# EasyEDA Pro project 4090ovo(003).epro, board 003(4090)
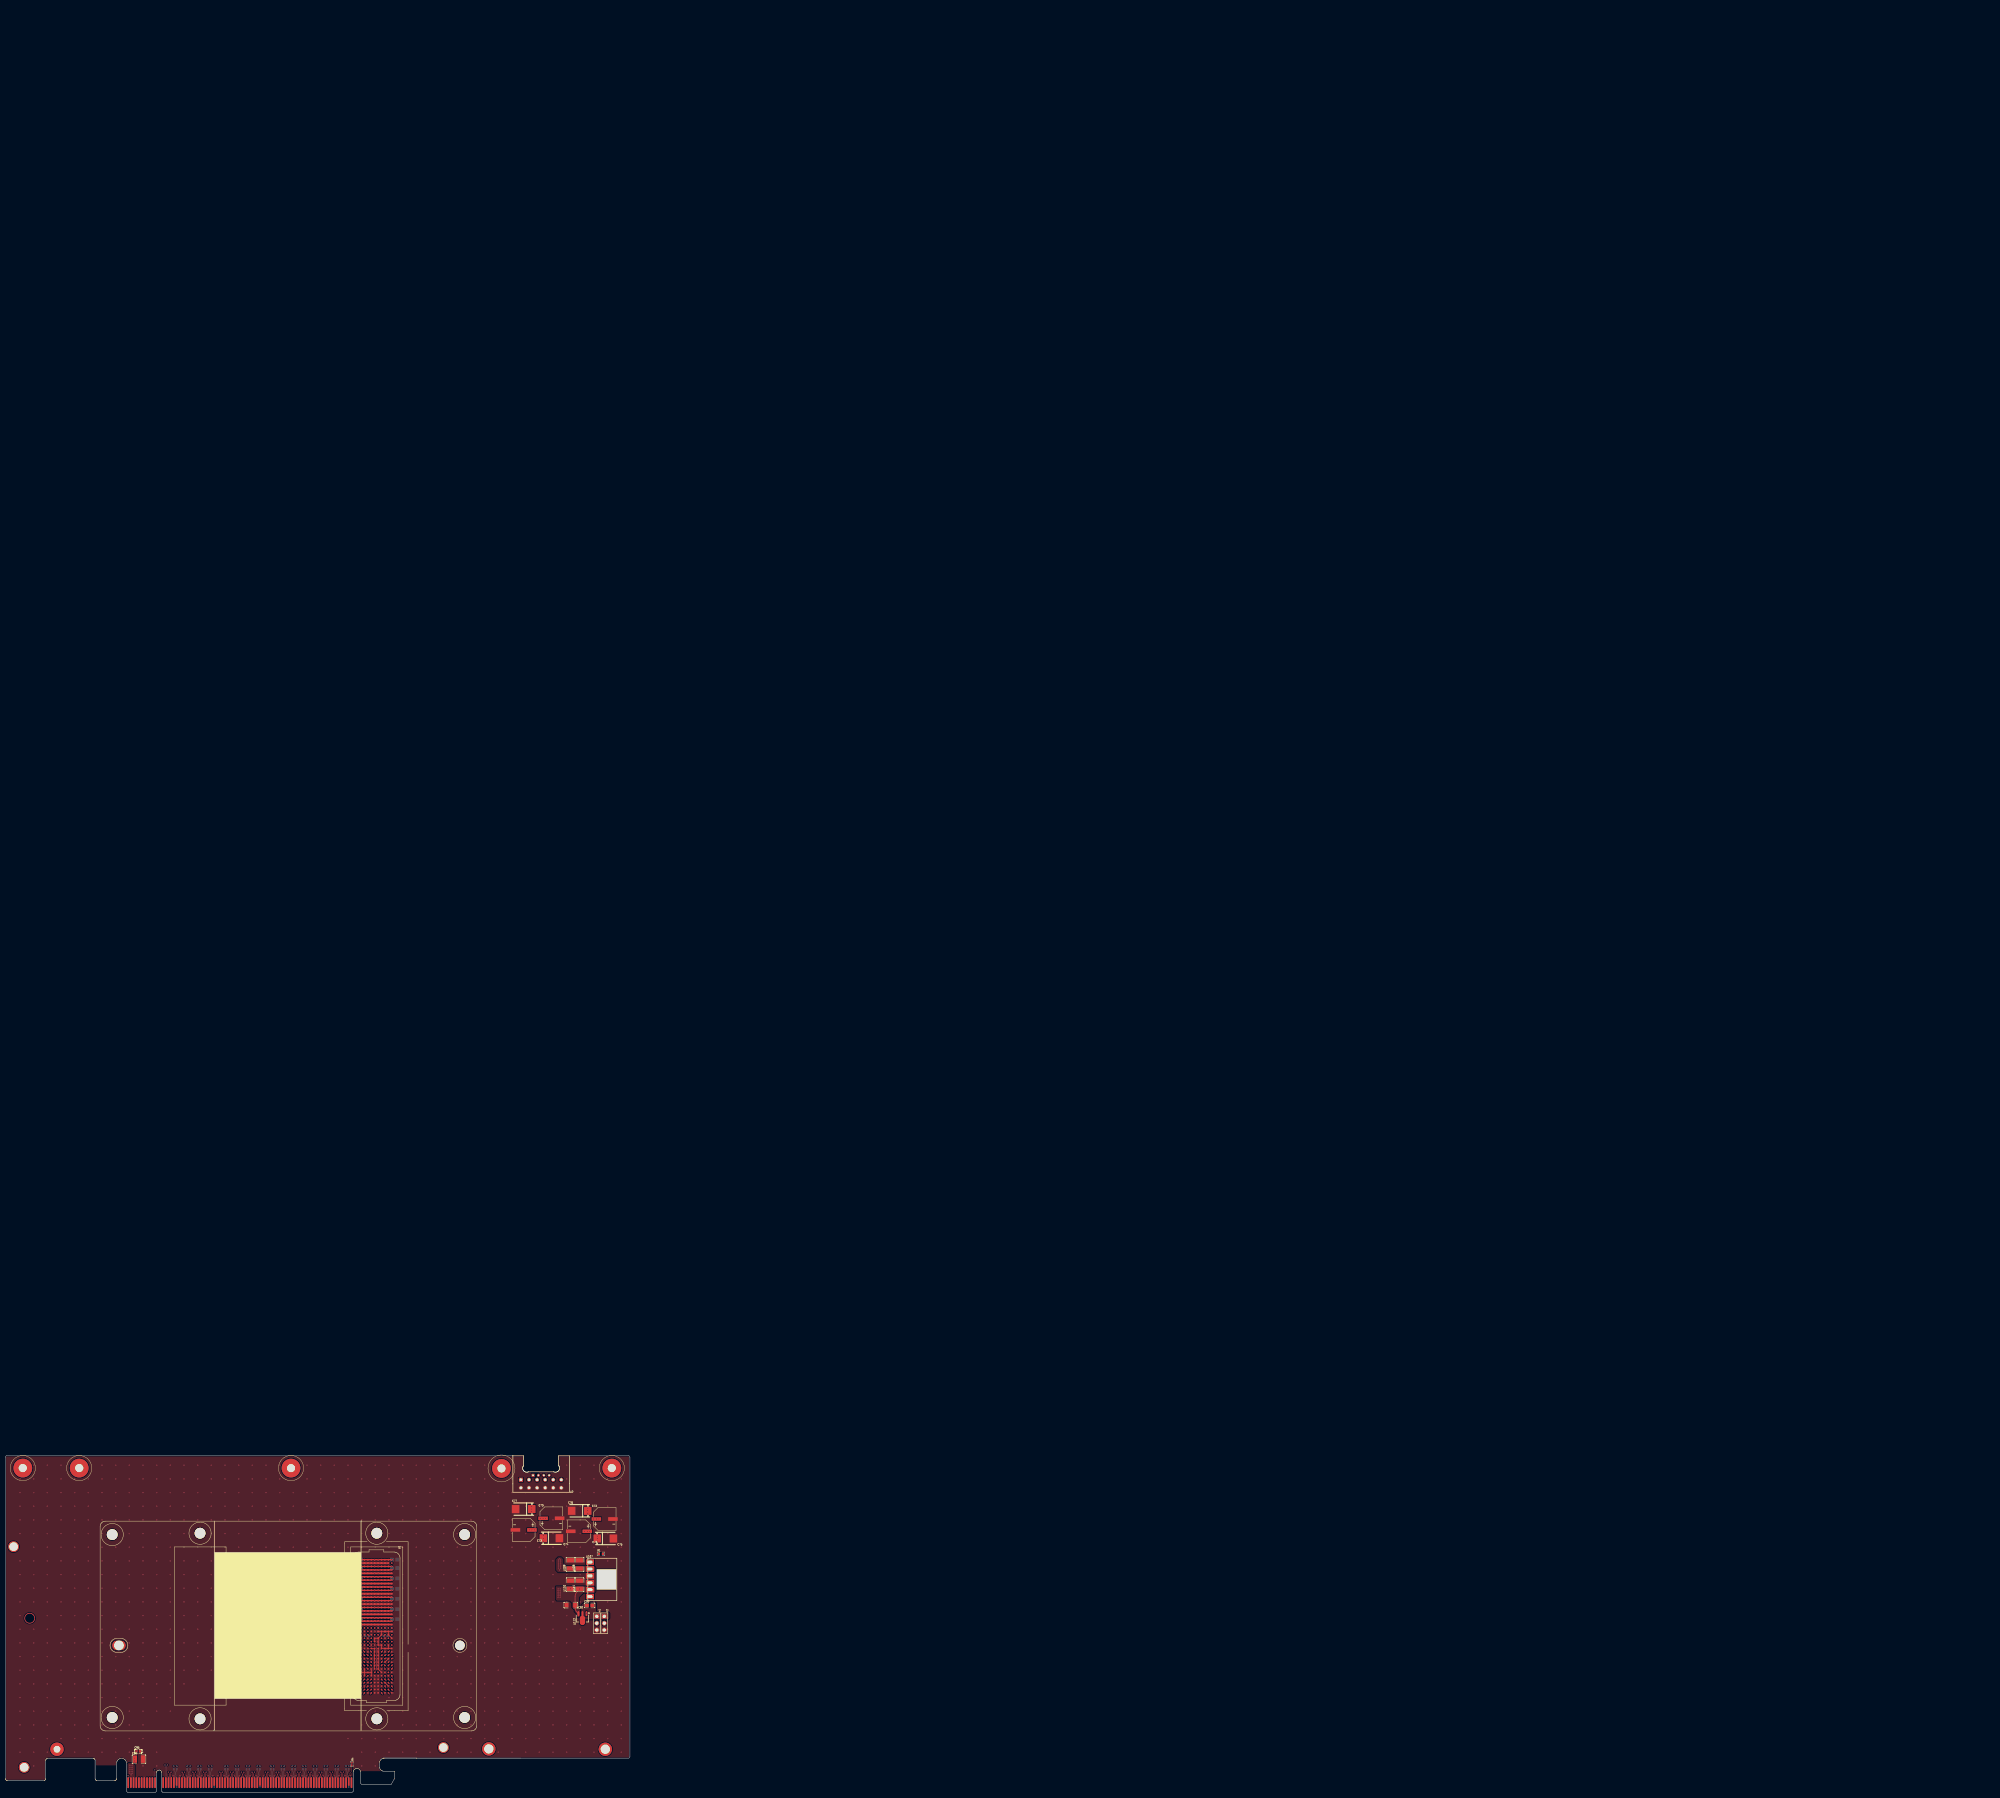
[diagram p0: board, top side]
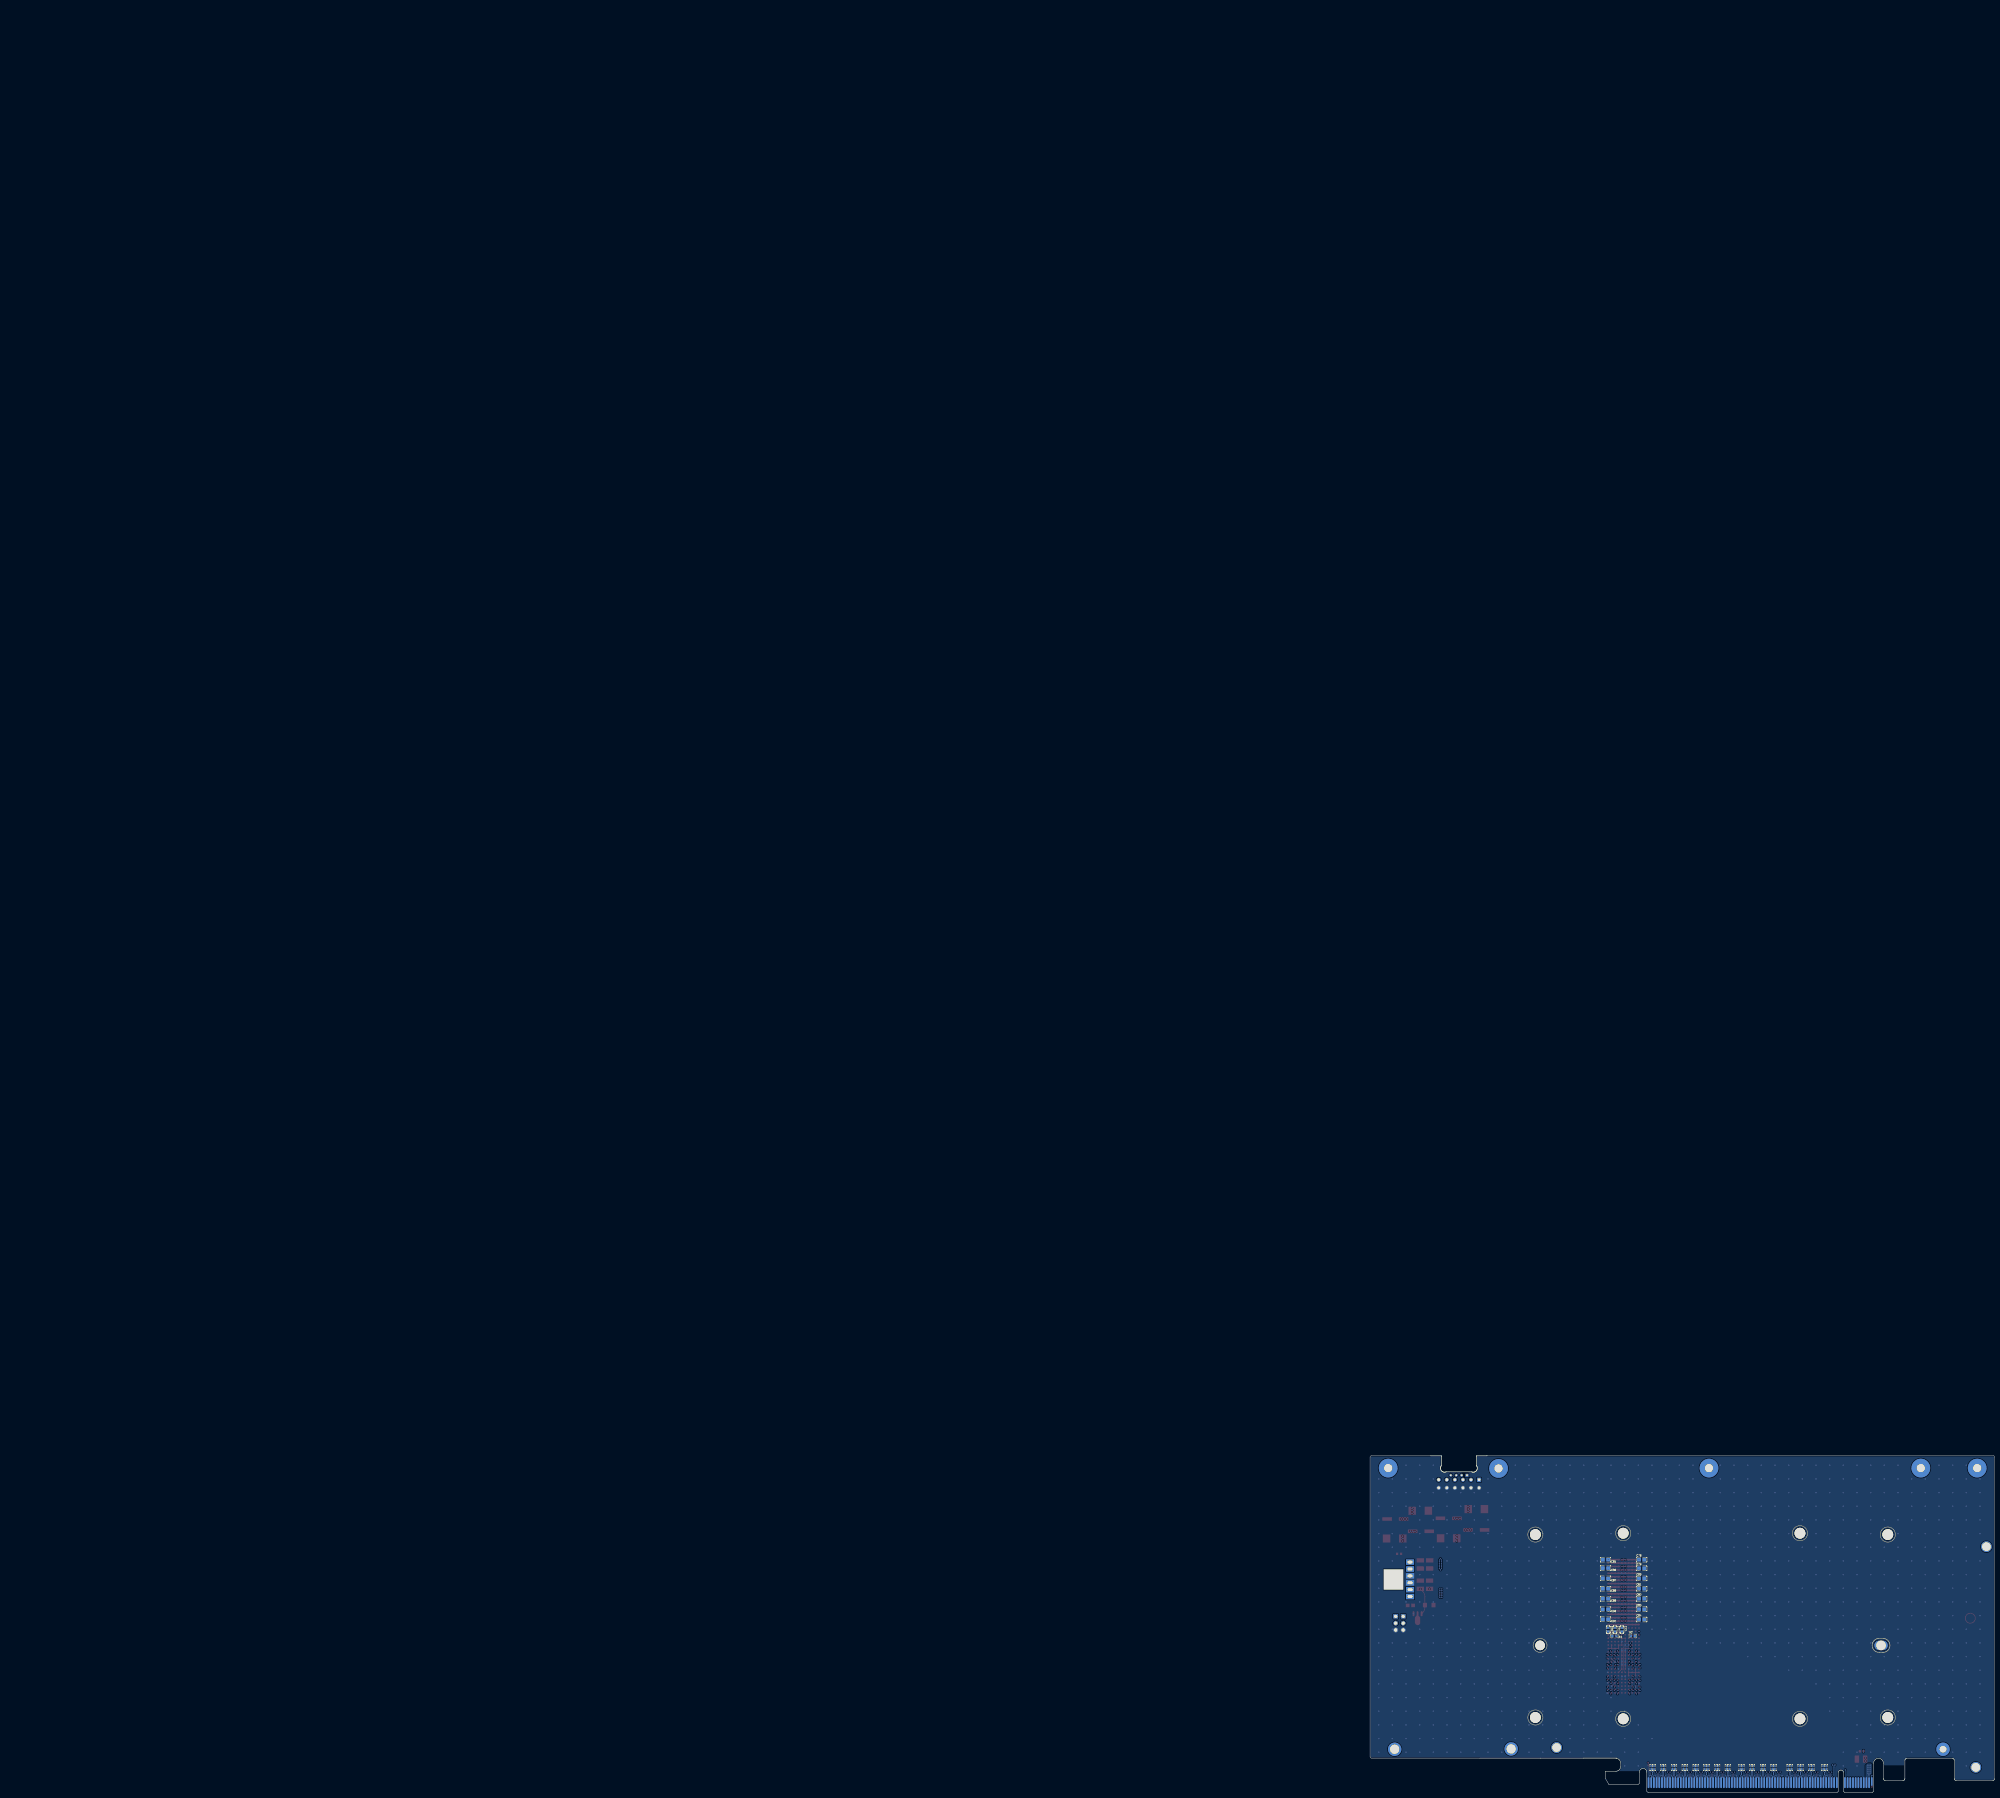
[diagram p1: board, bottom side, seen from below]

Outline 232.16 x 125.25 mm; copper layers: Top Layer, Inner1, Inner2, Inner3, Inner4, Bottom Layer. Coordinates in mm from the lower left corner of the outline.
Outline path: 0,5.25 0,124.75 arc(0.15,125.1) 0.5,125.25 188.73,125.25 188.73,125.22 ; 140.47,12.82 231.66,12.82 arc(232.01,12.97) 232.16,13.32 232.16,124.72 arc(232.01,125.08) 231.66,125.22 209.64,125.22
Stack: Top Layer 0.035mm 外层铜厚1oz / Dielectric1 0.0764mm 1080 RC67% 3.3mil / Inner1 0.0152mm 内层铜厚 / Dielectric2 0.55mm 0.55mm H/H No copper / Inner2 0.0152mm 内层铜厚 / Dielectric3 0.2028mm 7628 RC49% 8.6mil / Inner3 0.0152mm 内层铜厚 / Dielectric4 0.55mm 0.55mm H/H No copper / Inner4 0.0152mm 内层铜厚 / Dielectric5 0.0764mm 1080 RC67% 3.3mil / Bottom Layer 0.035mm 外层铜厚1oz

## Design rules (mm)
net TX8-: TX8
net TX15-: TX15
net TX7-: TX7
net TX3-: TX3
net TX0-: TX0
net TX6-: TX6
net TX9-: TX9
net TX12-: TX12
net TX10-: TX10
net TX1-: TX1
net TX4-: TX4
net TX13-: TX13
net RX8-: RX8
net RX8+: RX8
net CLK+: CLK
net CLK-: CLK
net PCIET0+: PCIET0
net PCIET0-: PCIET0
net PCIET1+: PCIET1
net PCIET1-: PCIET1
net PCIET2+: PCIET2
net PCIET2-: PCIET2
net PCIET3+: PCIET3
net PCIET3-: PCIET3
net PCIET5+: PCIET5
net PCIET5-: PCIET5
net PCIET6+: PCIET6
net PCIET6-: PCIET6
net PCIET7+: PCIET7
net PCIET7-: PCIET7
net PCIET8+: PCIET8
net PCIET8-: PCIET8
net PCIET9+: PCIET9
net PCIET9-: PCIET9
net PCIET10+: PCIET10
net PCIET10-: PCIET10
net PCIET11+: PCIET11
net PCIET11-: PCIET11
net PCIET12+: PCIET12
net PCIET12-: PCIET12
net PCIET13+: PCIET13
net PCIET13-: PCIET13
net PCIET14+: PCIET14
net PCIET14-: PCIET14
net PCIET15+: PCIET15
net PCIET15-: PCIET15
net RX11-: RX11
net RX0-: RX0
net RX15-: RX15
net RX3-: RX3
net RX1-: RX1
net RX10-: RX10
net RX4-: RX4
net RX9-: RX9
net RX12-: RX12
net RX5-: RX5
net RX7-: RX7
net RX0+: RX0
net RX11+: RX11
net RX15+: RX15
net RX7+: RX7
net RX6+: RX6
net RX14-: RX14
net RX3+: RX3
net RX6-: RX6
net RX14+: RX14
net RX13-: RX13
net RX4+: RX4
net RX10+: RX10
net RX1+: RX1
net RX13+: RX13
net RX12+: RX12
net RX5+: RX5
net RX9+: RX9
net RX2+: RX2
net RX2-: RX2
net TX3+: TX3
net TX8+: TX8
net TX7+: TX7
net TX15+: TX15
net TX0+: TX0
net TX14-: TX14
net TX11+: TX11
net TX6+: TX6
net TX14+: TX14
net TX11-: TX11
net TX5-: TX5
net TX9+: TX9
net TX2+: TX2
net TX12+: TX12
net TX2-: TX2
net TX5+: TX5
net TX1+: TX1
net TX10+: TX10
net TX4+: TX4
net TX13+: TX13
net PCIET4+: PCIET4
net PCIET4-: PCIET4
template: 用户自定义配置
spacing Default (default): track to track 0.152, other pairs 0 to 0.152
track width Default: min 0.102, default 0.102, max 25.4
track width trackWidth1 (default): min 0.102, default 0.13, max 2.54
differential pair differentialPair (default): width min 0.102, default 0.114, max 2.54; gap min 0.102, default 0.102
via Default (default): diameter min 0.003, default 0.45, max 100.025; hole min 0.003, default 0.3, max 59.995

## Placement (name value [footprint] x y rotation side)
C1  100nF  [C0402]  67.57 9.27 90 bottom
C2  100nF  [C0402]  68.71 9.27 90 bottom
C3  100nF  [C0402]  71.63 9.27 90 bottom
C4  100nF  [C0402]  72.65 9.27 90 bottom
C5  100nF  [C0402]  75.57 9.27 90 bottom
C6  100nF  [C0402]  76.71 9.27 90 bottom
C7  100nF  [C0402]  81.67 9.27 90 bottom
C8  100nF  [C0402]  82.68 9.27 90 bottom
C9  100nF  [C0402]  85.6 9.27 90 bottom
C10  100nF  [C0402]  86.62 9.27 90 bottom
C11  100nF  [C0402]  89.67 9.27 90 bottom
C12  100nF  [C0402]  90.68 9.27 90 bottom
C13  100nF  [C0402]  93.6 9.27 90 bottom
C14  100nF  [C0402]  94.62 9.27 90 bottom
C15  100nF  [C0402]  98.68 9.27 90 bottom
C16  100nF  [C0402]  99.7 9.27 90 bottom
C17  100nF  [C0402]  102.62 9.27 90 bottom
C18  100nF  [C0402]  103.64 9.27 90 bottom
C19  100nF  [C0402]  106.56 9.27 90 bottom
C20  100nF  [C0402]  107.7 9.27 90 bottom
C21  100nF  [C0402]  110.62 9.27 90 bottom
C22  100nF  [C0402]  111.64 9.27 90 bottom
C23  100nF  [C0402]  114.56 9.27 90 bottom
C24  100nF  [C0402]  115.7 9.27 90 bottom
C25  100nF  [C0402]  118.62 9.27 90 bottom
C26  100nF  [C0402]  119.64 9.27 90 bottom
C27  100nF  [C0402]  122.69 9.27 90 bottom
C28  100nF  [C0402]  123.7 9.27 90 bottom
C29  100nF  [C0402]  126.62 9.27 90 bottom
C30  100nF  [C0402]  127.64 9.27 90 bottom
C61  100nF  [C0402]  62.62 9.27 90 bottom
C62  100nF  [C0402]  63.76 9.27 90 bottom
C70  100nF  [C0603]  143.64 60.57 270 bottom
C71  100nF  [C0603]  141.14 60.57 270 bottom
C72  100nF  [C0603]  138.56 60.57 270 bottom
C73  -  [CAP-SMD_BD8.0-L8.3-W8.3-LS8.5-FD]  202.95 101.98 0 top
C73#2  -  [CAP-SMD_BD8.0-L8.3-W8.3-LS8.5-FD]  192.66 97.66 180 top
C73#3  -  [CAP-SMD_BD8.0-L8.3-W8.3-LS8.5-FD]  213.24 97.15 180 top
C73#4  -  [CAP-SMD_BD8.0-L8.3-W8.3-LS8.5-FD]  222.76 101.72 0 top
C74  47uF  [CASE-D_7343]  202.95 94.56 180 top
C75  47uF  [CASE-D_7343]  223.02 94.48 180 top
C76  47uF  [CASE-D_7343]  213.49 104.77 0 top
C77  47uF  [CASE-D_7343]  192.66 105.4 0 top
C78  1uF  [C0805]  131.2 86.61 180 bottom
C79  1uF  [C0805]  131.2 83.39 180 bottom
C80  1uF  [C0805]  131.2 79.62 180 bottom
C81  1uF  [C0805]  131.2 75.83 180 bottom
C82  1uF  [C0805]  131.2 72.05 180 bottom
C83  1uF  [C0805]  131.2 68.17 180 bottom
C84  1uF  [C0805]  131.2 64.36 180 bottom
C85  1uF  [C0805]  144.66 86.61 0 bottom
C86  1uF  [C0805]  144.66 83.46 0 bottom
C87  1uF  [C0805]  144.66 79.65 0 bottom
C88  1uF  [C0805]  144.66 75.8 0 bottom
C89  1uF  [C0805]  144.66 72.05 0 bottom
C90  1uF  [C0805]  144.66 68.17 0 bottom
C91  1uF  [C0805]  144.66 64.46 0 bottom
C92  22uF  [C1206]  210.19 69.72 180 top
C93  10uF  [C0805]  217.17 69.59 0 top
C94  47uF  [C1210]  49.66 12.44 0 top
C95  10uF  [C0603]  49.41 15.36 0 top
F1  -  [Gold Finger CEM GEN5x16]  87.51 12.95 0 top
H1  2.54-1*3P针  [HDR-TH_3P-P2.54-V-M-1]  219.84 62.99 270 top
H2  2.54-1*3P针  [HDR-TH_3P-P2.54-V-M-1]  222.64 62.99 270 top
J54  -  [ProPrj_S2W_SXM2_GPU_2025-01-11:MODULE_SXM2]  169.68 55.37 0 top
NOREF  -  [Pad_e527]  223.02 16.12 0 top
NOREF#2  -  [Pad_e0]  6.99 9.39 0 top
NOREF#3  -  [Pad_e542]  106.18 120.65 0 top
NOREF#4  -  [Pad_e432]  162.82 16.76 0 top
NOREF#5  -  [Pad_e434]  3.05 91.44 0 top
NOREF#6  -  [Pad_e89]  179.71 16.25 0 top
NOREF#7  -  [Pad_e90]  19.18 16.12 0 top
NOREF#8  -  [Pad_e538]  27.44 120.65 0 top
NOREF#9  -  [Pad_e570]  225.43 120.65 0 top
NOREF#10  -  [Pad_e82]  6.48 120.65 0 top
NOREF#11  -  [Pad_e526]  184.41 120.52 0 top
R1  112  [R0603]  221.37 88.77 0 top
R2  10K  [R0603]  134.5 58.29 180 bottom
R3  10K  [R0603]  141.36 58.29 0 bottom
R4  0Ω  [R0402]  128.78 10.66 270 top
U1  84740-102LF  [CONN-SMD_400P-P1.27_84740-002LF]  137.93 61.84 270 top
U2  -  [10160920-1240100LF PCIE-5.0 12+4PIN电源接口]  199.14 114.8 180 top
U107  -  [ZXDN10S最小封装]  217.3 72.89 0 top
U108  100uF/16V-C1210  [C1210]  213.49 84.83 90 top
U109  100uF/16V-C1210  [C1210]  210 84.83 90 top
U110  100uF/16V-C1210  [C1210]  210.03 77.29 90 top
U111  100uF/16V-C1210  [C1210]  213.49 77.29 90 top
U112  AMS1117-1.8V  [SOT-89-3_L4.5-W2.5-P1.50-LS4.1-BR]  214.51 65.27 90 top

## Footprints (pads in the part's own frame, mm; a bottom-side part is the same pattern mirrored in y, then rotated)
10160920-1240100LF PCIE-5.0 12+4PIN电源接口
  rect 1.52x1.52 hole 1.02: 1(7.5,-1.5)
  round 1.52 hole 1.02: 2(4.5,-1.5) 3(1.5,-1.5) 4(-1.5,-1.5) 5(-4.5,-1.5) 6(-7.5,-1.5) 7(7.5,1.5) 8(4.5,1.5) 9(1.5,1.5) 10(-1.5,1.5) 11(-4.5,1.5) 12(-7.5,1.5)
  rect 1.1x1.1 hole 0.6: s1(3,-3.17)
  round 1.1 hole 0.6: s2(1,-3.17) s3(-1,-3.17) s4(-3,-3.17)
C0402
  rect 0.79x0.54 smd: 1(-0.545,0) 2(0.545,0)
C0603
  rect 0.8x0.9 smd: 1(-0.7,0) 2(0.7,0)
C0805
  rect 1.41x1.35 smd: 1(-1,0) 2(1,0)
C1206
  rect 1.485x1.728 smd: 1(-1.593,0) 2(1.593,0)
C1210
  rect 1.635x2.7 smd: 1(-1.518,0) 2(1.518,0)
CAP-SMD_BD8.0-L8.3-W8.3-LS8.5-FD
  rect 3.56x1.33 smd: 1(-3.07,0) 2(3.07,0)
CASE-D_7343
  rect 2.799x3.01 smd: 1(3,0) 2(-3,0)
CONN-SMD_400P-P1.27_84740-002LF
  round 0.66 smd: A1(24.765,-5.715) A2(23.495,-5.715) A3(22.225,-5.715) A4(20.955,-5.715) A5(19.685,-5.715) A6(18.415,-5.715) A7(17.145,-5.715) A8(15.875,-5.715) A9(14.605,-5.715) A10(13.335,-5.715) A11(12.065,-5.715) A12(10.795,-5.715) A13(9.525,-5.715) A14(8.255,-5.715) A15(6.985,-5.715) A16(5.715,-5.715) A17(4.445,-5.715) A18(3.175,-5.715) A19(1.905,-5.715) A20(0.635,-5.715) A21(-0.635,-5.715) A22(-1.905,-5.715) A23(-3.175,-5.715) A24(-4.445,-5.715) A25(-5.715,-5.715) A26(-6.985,-5.715) A27(-8.255,-5.715) A28(-9.525,-5.715) A29(-10.795,-5.715) A30(-12.065,-5.715) A31(-13.335,-5.715) A32(-14.605,-5.715) A33(-15.875,-5.715) A34(-17.145,-5.715) A35(-18.415,-5.715) A36(-19.685,-5.715) A37(-20.955,-5.715) A38(-22.225,-5.715) A39(-23.495,-5.715) A40(-24.765,-5.715) B1(24.765,-4.445) B2(23.495,-4.445) B3(22.225,-4.445) B4(20.955,-4.445) B5(19.685,-4.445) B6(18.415,-4.445) B7(17.145,-4.445) B8(15.875,-4.445) B9(14.605,-4.445) B10(13.335,-4.445) B11(12.065,-4.445) B12(10.795,-4.445) B13(9.525,-4.445) B14(8.255,-4.445) B15(6.985,-4.445) B16(5.715,-4.445) B17(4.445,-4.445) B18(3.175,-4.445) B19(1.905,-4.445) B20(0.635,-4.445) B21(-0.635,-4.445) B22(-1.905,-4.445) B23(-3.175,-4.445) B24(-4.445,-4.445) B25(-5.715,-4.445) B26(-6.985,-4.445) B27(-8.255,-4.445) B28(-9.525,-4.445) B29(-10.795,-4.445) B30(-12.065,-4.445) B31(-13.335,-4.445) B32(-14.605,-4.445) B33(-15.875,-4.445) B34(-17.145,-4.445) B35(-18.415,-4.445) B36(-19.685,-4.445) B37(-20.955,-4.445) B38(-22.225,-4.445) B39(-23.495,-4.445) B40(-24.765,-4.445) C1(24.765,-3.175) C2(23.495,-3.175) C3(22.225,-3.175) C4(20.955,-3.175) C5(19.685,-3.175) C6(18.415,-3.175) C7(17.145,-3.175) C8(15.875,-3.175) C9(14.605,-3.175) C10(13.335,-3.175) C11(12.065,-3.175) C12(10.795,-3.175) C13(9.525,-3.175) C14(8.255,-3.175) C15(6.985,-3.175) C16(5.715,-3.175) C17(4.445,-3.175) C18(3.175,-3.175) C19(1.905,-3.175) C20(0.635,-3.175) C21(-0.635,-3.175) C22(-1.905,-3.175) C23(-3.175,-3.175) C24(-4.445,-3.175) C25(-5.715,-3.175) C26(-6.985,-3.175) C27(-8.255,-3.175) C28(-9.525,-3.175) C29(-10.795,-3.175) C30(-12.065,-3.175) C31(-13.335,-3.175) C32(-14.605,-3.175) C33(-15.875,-3.175) C34(-17.145,-3.175) C35(-18.415,-3.175) C36(-19.685,-3.175) C37(-20.955,-3.175) C38(-22.225,-3.175) C39(-23.495,-3.175) C40(-24.765,-3.175) D1(24.765,-1.905) D2(23.495,-1.905) D3(22.225,-1.905) D4(20.955,-1.905) D5(19.685,-1.905) D6(18.415,-1.905) D7(17.145,-1.905) D8(15.875,-1.905) D9(14.605,-1.905) D10(13.335,-1.905) D11(12.065,-1.905) D12(10.795,-1.905) D13(9.525,-1.905) D14(8.255,-1.905) D15(6.985,-1.905) D16(5.715,-1.905) D17(4.445,-1.905) D18(3.175,-1.905) D19(1.905,-1.905) D20(0.635,-1.905) D21(-0.635,-1.905) D22(-1.905,-1.905) D23(-3.175,-1.905) D24(-4.445,-1.905) D25(-5.715,-1.905) D26(-6.985,-1.905) D27(-8.255,-1.905) D28(-9.525,-1.905) D29(-10.795,-1.905) D30(-12.065,-1.905) D31(-13.335,-1.905) D32(-14.605,-1.905) D33(-15.875,-1.905) D34(-17.145,-1.905) D35(-18.415,-1.905) D36(-19.685,-1.905) D37(-20.955,-1.905) D38(-22.225,-1.905) D39(-23.495,-1.905) D40(-24.765,-1.905) E1(24.765,-0.635) E2(23.495,-0.635) E3(22.225,-0.635) E4(20.955,-0.635) E5(19.685,-0.635) E6(18.415,-0.635) E7(17.145,-0.635) E8(15.875,-0.635) E9(14.605,-0.635) E10(13.335,-0.635) E11(12.065,-0.635) E12(10.795,-0.635) E13(9.525,-0.635) E14(8.255,-0.635) E15(6.985,-0.635) E16(5.715,-0.635) E17(4.445,-0.635) E18(3.175,-0.635) E19(1.905,-0.635) E20(0.635,-0.635) E21(-0.635,-0.635) E22(-1.905,-0.635) E23(-3.175,-0.635) E24(-4.445,-0.635) E25(-5.715,-0.635) E26(-6.985,-0.635) E27(-8.255,-0.635) E28(-9.525,-0.635) E29(-10.795,-0.635) E30(-12.065,-0.635) E31(-13.335,-0.635) E32(-14.605,-0.635) E33(-15.875,-0.635) E34(-17.145,-0.635) E35(-18.415,-0.635) E36(-19.685,-0.635) E37(-20.955,-0.635) E38(-22.225,-0.635) E39(-23.495,-0.635) E40(-24.765,-0.635) F1(24.765,0.635) F2(23.495,0.635) F3(22.225,0.635) F4(20.955,0.635) F5(19.685,0.635) F6(18.415,0.635) F7(17.145,0.635) F8(15.875,0.635) F9(14.605,0.635) F10(13.335,0.635) F11(12.065,0.635) F12(10.795,0.635) F13(9.525,0.635) F14(8.255,0.635) F15(6.985,0.635) F16(5.715,0.635) F17(4.445,0.635) F18(3.175,0.635) F19(1.905,0.635) F20(0.635,0.635) F21(-0.635,0.635) F22(-1.905,0.635) F23(-3.175,0.635) F24(-4.445,0.635) F25(-5.715,0.635) F26(-6.985,0.635) F27(-8.255,0.635) F28(-9.525,0.635) F29(-10.795,0.635) F30(-12.065,0.635) F31(-13.335,0.635) F32(-14.605,0.635) F33(-15.875,0.635) F34(-17.145,0.635) F35(-18.415,0.635) F36(-19.685,0.635) F37(-20.955,0.635) F38(-22.225,0.635) F39(-23.495,0.635) F40(-24.765,0.635) G1(24.765,1.905) G2(23.495,1.905) G3(22.225,1.905) G4(20.955,1.905) G5(19.685,1.905) G6(18.415,1.905) G7(17.145,1.905) G8(15.875,1.905) G9(14.605,1.905) G10(13.335,1.905) G11(12.065,1.905) G12(10.795,1.905) G13(9.525,1.905) G14(8.255,1.905) G15(6.985,1.905) G16(5.715,1.905) G17(4.445,1.905) G18(3.175,1.905) G19(1.905,1.905) G20(0.635,1.905) G21(-0.635,1.905) G22(-1.905,1.905) G23(-3.175,1.905) G24(-4.445,1.905) G25(-5.715,1.905) G26(-6.985,1.905) G27(-8.255,1.905) G28(-9.525,1.905) G29(-10.795,1.905) G30(-12.065,1.905) G31(-13.335,1.905) G32(-14.605,1.905) G33(-15.875,1.905) G34(-17.145,1.905) G35(-18.415,1.905) G36(-19.685,1.905) G37(-20.955,1.905) G38(-22.225,1.905) G39(-23.495,1.905) G40(-24.765,1.905) H1(24.765,3.175) H2(23.495,3.175) H3(22.225,3.175) H4(20.955,3.175) H5(19.685,3.175) H6(18.415,3.175) H7(17.145,3.175) H8(15.875,3.175) H9(14.605,3.175) H10(13.335,3.175) H11(12.065,3.175) H12(10.795,3.175) H13(9.525,3.175) H14(8.255,3.175) H15(6.985,3.175) H16(5.715,3.175) H17(4.445,3.175) H18(3.175,3.175) H19(1.905,3.175) H20(0.635,3.175) H21(-0.635,3.175) H22(-1.905,3.175) H23(-3.175,3.175) H24(-4.445,3.175) H25(-5.715,3.175) H26(-6.985,3.175) H27(-8.255,3.175) H28(-9.525,3.175) H29(-10.795,3.175) H30(-12.065,3.175) H31(-13.335,3.175) H32(-14.605,3.175) H33(-15.875,3.175) H34(-17.145,3.175) H35(-18.415,3.175) H36(-19.685,3.175) H37(-20.955,3.175) H38(-22.225,3.175) H39(-23.495,3.175) H40(-24.765,3.175) J1(24.765,4.445) J2(23.495,4.445) J3(22.225,4.445) J4(20.955,4.445) J5(19.685,4.445) J6(18.415,4.445) J7(17.145,4.445) J8(15.875,4.445) J9(14.605,4.445) J10(13.335,4.445) J11(12.065,4.445) J12(10.795,4.445) J13(9.525,4.445) J14(8.255,4.445) J15(6.985,4.445) J16(5.715,4.445) J17(4.445,4.445) J18(3.175,4.445) J19(1.905,4.445) J20(0.635,4.445) J21(-0.635,4.445) J22(-1.905,4.445) J23(-3.175,4.445) J24(-4.445,4.445) J25(-5.715,4.445) J26(-6.985,4.445) J27(-8.255,4.445) J28(-9.525,4.445) J29(-10.795,4.445) J30(-12.065,4.445) J31(-13.335,4.445) J32(-14.605,4.445) J33(-15.875,4.445) J34(-17.145,4.445) J35(-18.415,4.445) J36(-19.685,4.445) J37(-20.955,4.445) J38(-22.225,4.445) J39(-23.495,4.445) J40(-24.765,4.445) K1(24.765,5.715) K2(23.495,5.715) K3(22.225,5.715) K4(20.955,5.715) K5(19.685,5.715) K6(18.415,5.715) K7(17.145,5.715) K8(15.875,5.715) K9(14.605,5.715) K10(13.335,5.715) K11(12.065,5.715) K12(10.795,5.715) K13(9.525,5.715) K14(8.255,5.715) K15(6.985,5.715) K16(5.715,5.715) K17(4.445,5.715) K18(3.175,5.715) K19(1.905,5.715) K20(0.635,5.715) K21(-0.635,5.715) K22(-1.905,5.715) K23(-3.175,5.715) K24(-4.445,5.715) K25(-5.715,5.715) K26(-6.985,5.715) K27(-8.255,5.715) K28(-9.525,5.715) K29(-10.795,5.715) K30(-12.065,5.715) K31(-13.335,5.715) K32(-14.605,5.715) K33(-15.875,5.715) K34(-17.145,5.715) K35(-18.415,5.715) K36(-19.685,5.715) K37(-20.955,5.715) K38(-22.225,5.715) K39(-23.495,5.715) K40(-24.765,5.715)
Gold Finger CEM GEN5x16
  oval 0.635x3.251 smd far side: A1(-41.858,-8.834)
  oval 0.635x4.064 smd far side: A2(-40.858,-9.24) A3(-39.858,-9.24) A4(-38.858,-9.24) A5(-37.858,-9.24) A6(-36.858,-9.24) A7(-35.858,-9.24) A8(-34.858,-9.24) A9(-33.858,-9.24) A10(-32.858,-9.24) A11(-31.858,-9.24) A12(-28.858,-9.24) A13(-27.858,-9.24) A14(-26.858,-9.24) A15(-25.858,-9.24) A16(-24.858,-9.24) A17(-23.858,-9.24) A18(-22.858,-9.24) A19(-21.858,-9.24) A20(-20.858,-9.24) A21(-19.858,-9.24) A22(-18.858,-9.24) A23(-17.858,-9.24) A24(-16.858,-9.24) A25(-15.858,-9.24) A26(-14.858,-9.24) A27(-13.858,-9.24) A28(-12.858,-9.24) A29(-11.858,-9.24) A30(-10.858,-9.24) A31(-9.858,-9.24) A32(-8.858,-9.24) A33(-7.858,-9.24) A34(-6.858,-9.24) A35(-5.858,-9.24) A36(-4.858,-9.24) A37(-3.858,-9.24) A38(-2.858,-9.24) A39(-1.858,-9.24) A40(-0.858,-9.24) A41(0.142,-9.24) A42(1.142,-9.24) A43(2.142,-9.24) A44(3.142,-9.24) A45(4.142,-9.24) A46(5.142,-9.24) A47(6.142,-9.24) A48(7.142,-9.24) A49(8.142,-9.24) A50(9.142,-9.24) A51(10.142,-9.24) A52(11.142,-9.24) A53(12.142,-9.24) A54(13.142,-9.24) A55(14.142,-9.24) A56(15.142,-9.24) A57(16.142,-9.24) A58(17.142,-9.24) A59(18.142,-9.24) A60(19.142,-9.24) A61(20.142,-9.24) A62(21.142,-9.24) A63(22.142,-9.24) A64(23.142,-9.24) A65(24.142,-9.24) A66(25.142,-9.24) A67(26.142,-9.24) A68(27.142,-9.24) A69(28.142,-9.24) A70(29.142,-9.24) A71(30.142,-9.24) A72(31.142,-9.24) A73(32.142,-9.24) A74(33.142,-9.24) A75(34.142,-9.24) A76(35.142,-9.24) A77(36.142,-9.24) A78(37.142,-9.24) A79(38.142,-9.24) A80(39.142,-9.24) A81(40.142,-9.24) A82(41.142,-9.24)
  oval 0.635x4.064 smd: B1(-41.858,-9.25) B2(-40.858,-9.24) B3(-39.858,-9.24) B4(-38.858,-9.24) B5(-37.858,-9.24) B6(-36.858,-9.24) B7(-35.858,-9.24) B8(-34.858,-9.24) B9(-33.858,-9.24) B10(-32.858,-9.24) B11(-31.858,-9.24) B12(-28.858,-9.24) B13(-27.858,-9.24) B14(-26.858,-9.24) B15(-25.858,-9.24) B16(-24.858,-9.24) B18(-22.858,-9.24) B19(-21.858,-9.24) B20(-20.858,-9.24) B21(-19.858,-9.24) B22(-18.858,-9.24) B23(-17.858,-9.24) B24(-16.858,-9.24) B25(-15.858,-9.24) B26(-14.858,-9.24) B27(-13.858,-9.24) B28(-12.858,-9.24) B29(-11.858,-9.24) B30(-10.858,-9.24) B32(-8.858,-9.24) B33(-7.858,-9.24) B34(-6.858,-9.24) B35(-5.858,-9.24) B36(-4.858,-9.24) B37(-3.858,-9.24) B38(-2.858,-9.24) B39(-1.858,-9.24) B40(-0.858,-9.24) B41(0.142,-9.24) B42(1.142,-9.24) B43(2.142,-9.24) B44(3.142,-9.24) B45(4.142,-9.24) B46(5.142,-9.24) B47(6.142,-9.24) B49(8.142,-9.24) B50(9.142,-9.24) B51(10.142,-9.24) B52(11.142,-9.24) B53(12.142,-9.24) B54(13.142,-9.24) B55(14.142,-9.24) B56(15.142,-9.24) B57(16.142,-9.24) B58(17.142,-9.24) B59(18.142,-9.24) B60(19.142,-9.24) B61(20.142,-9.24) B62(21.142,-9.24) B63(22.142,-9.24) B64(23.142,-9.24) B65(24.142,-9.24) B66(25.142,-9.24) B67(26.142,-9.24) B68(27.142,-9.24) B69(28.142,-9.24) B70(29.142,-9.24) B71(30.142,-9.24) B72(31.142,-9.24) B73(32.142,-9.24) B74(33.142,-9.24) B75(34.142,-9.24) B76(35.142,-9.24) B77(36.142,-9.24) B78(37.142,-9.24) B79(38.142,-9.24) B80(39.142,-9.24) B82(41.142,-9.24)
  oval 0.635x3.251 smd: B17(-23.858,-8.834) B31(-9.858,-8.834) B48(7.142,-8.834) B81(40.142,-8.834)
HDR-TH_3P-P2.54-V-M-1
  rect 1.575x1.8 hole 1.2: 1(-2.54,0)
  round 1.8 hole 1.2: 2(0,0) 3(2.54,0)
Pad_e0
  round 4 hole 3.2: 1(0,0)
Pad_e82
  round 7 hole 3: 3(0,0)
Pad_e89
  round 5 hole 3.4: 3(0,0)
Pad_e90
  round 5 hole 2.5: 3(0,0)
Pad_e432
  round 4 hole 3.2: 1(0,0)
Pad_e434
  round 4 hole 3.2: 1(0,0)
Pad_e526
  round 7 hole 3: 3(0,0)
Pad_e527
  round 5 hole 3.4: 3(0,0)
Pad_e538
  round 7 hole 3: 3(0,0)
Pad_e542
  round 7 hole 3: 3(0,0)
Pad_e570
  round 7 hole 3: 3(0,0)
ProPrj_S2W_SXM2_GPU_2025-01-11:MODULE_SXM2
  round 4.013 hole 4.013: MH1(1.039,40.565) MH2(-31.611,41.065) MH3(-97.311,41.065) MH4(-129.96,40.565) MH5(1.039,-27.435) MH7(-97.311,-27.935) MH8(-129.96,-27.435)
  oval 4.013x4.013 hole 4.013: MH6(-31.611,-27.935)
  round 3.556 hole 3.556: MH9(-0.711,-0.635)
  oval 5.004x3.556 hole 3.556: MH10(-127.461,-0.635)
R0402
  rect 0.566x0.54 smd: 1(-0.433,0) 2(0.433,0)
R0603
  rect 0.806x0.864 smd: 1(-0.753,0) 2(0.753,0)
SOT-89-3_L4.5-W2.5-P1.50-LS4.1-BR
  oval 1.9x0.7 smd: 1(1.25,-1.501) 3(1.25,1.501)
  oval 3.5x2 smd: 2(-1.25,0)
  oval 2.1x0.7 smd: 2(1.151,0)
ZXDN10S最小封装
  rect 3x2 hole 1.9x1.05: 1(0,0) 2(0,2.56) 3(0,5.12) 4(0,7.68) 5(0,10.24) 6(0,12.8)

## Nets
1.8V: H1.1 H2.1 U112.2
+3V3: F1.A9 F1.A10 F1.B8
+5V: C70.1 C71.1 C72.1 C92.1 U1.F20 U1.G20 U1.H20 U1.J20 U1.K20 U107.2 U110.1 U111.1 U112.3
+12V: C73.1 C73#2.1 C73#3.1 C73#4.1 C74.1 C75.1 C76.1 C77.1 C78.1 C79.1 C80.1 C81.1 C82.1 C83.1 C84.1 C85.1 C86.1 C87.1 C88.1 C89.1 C90.1 C91.1 C94.1 C95.1 F1.A2 F1.A3 F1.B1 F1.B2 F1.B3 U1.A22 U1.A23 U1.A25 U1.A26 U1.A28 U1.A29 U1.A31 U1.A32 U1.A34 U1.A35 U1.A37 U1.A38 U1.A40 U1.B22 U1.B23 U1.B25 U1.B26 U1.B28 U1.B29 U1.B31 U1.B32 U1.B34 U1.B35 U1.B37 U1.B38 U1.B40 U1.C22 U1.C23 U1.C25 U1.C26 U1.C28 U1.C29 U1.C31 U1.C32 U1.C34 U1.C35 U1.C37 U1.C38 U1.C40 U1.D22 U1.D23 U1.D25 U1.D26 U1.D28 U1.D29 U1.D31 U1.D32 U1.D34 U1.D35 U1.D37 U1.D38 U1.D40 U1.E22 U1.E23 U1.E25 U1.E26 U1.E28 U1.E29 U1.E31 U1.E32 U1.E34 U1.E35 U1.E37 U1.E38 U1.E40 U1.F22 U1.F23 U1.F25 U1.F26 U1.F28 U1.F29 U1.F31 U1.F32 U1.F34 U1.F35 U1.F37 U1.F38 U1.F40 U1.G22 U1.G23 U1.G25 U1.G26 U1.G28 U1.G29 U1.G31 U1.G32 U1.G34 U1.G35 U1.G37 U1.G38 U1.G40 U1.H22 U1.H23 U1.H25 U1.H26 U1.H28 U1.H29 U1.H31 U1.H32 U1.H34 U1.H35 U1.H37 U1.H38 U1.H40 U1.J22 U1.J23 U1.J25 U1.J26 U1.J28 U1.J29 U1.J31 U1.J32 U1.J34 U1.J35 U1.J37 U1.J38 U1.J40 U1.K22 U1.K23 U1.K25 U1.K26 U1.K28 U1.K29 U1.K31 U1.K32 U1.K34 U1.K35 U1.K37 U1.K38 U1.K40 U2.1 U2.2 U2.3 U2.4 U2.5 U2.6 U107.5 U108.1 U109.1
GND: C70.2 C71.2 C72.2 C73.2 C73#2.2 C73#3.2 C73#4.2 C74.2 C75.2 C76.2 C77.2 C78.2 C79.2 C80.2 C81.2 C82.2 C83.2 C84.2 C85.2 C86.2 C87.2 C88.2 C89.2 C91.2 C92.2 C94.2 C95.2 F1.A4 F1.A12 F1.A15 F1.A18 F1.A20 F1.A23 F1.A24 F1.A27 F1.A28 F1.A31 F1.A34 F1.A37 F1.A38 F1.A41 F1.A42 F1.A45 F1.A46 F1.A49 F1.A51 F1.A54 F1.A55 F1.A58 F1.A59 F1.A62 F1.A63 F1.A66 F1.A67 F1.A70 F1.A71 F1.A74 F1.A75 F1.A78 F1.A79 F1.A82 F1.B4 F1.B7 F1.B13 F1.B16 F1.B18 F1.B21 F1.B22 F1.B25 F1.B26 F1.B29 F1.B32 F1.B35 F1.B36 F1.B39 F1.B40 F1.B43 F1.B44 F1.B47 F1.B49 F1.B52 F1.B53 F1.B56 F1.B57 F1.B60 F1.B61 F1.B64 F1.B65 F1.B68 F1.B69 F1.B72 F1.B73 F1.B76 F1.B77 F1.B80 H1.3 H2.3 R2.2 R3.2 U1.A1 U1.A4 U1.A7 U1.A10 U1.A13 U1.A14 U1.A17 U1.A21 U1.A24 U1.A27 U1.A30 U1.A33 U1.A36 U1.A39 U1.B3 U1.B6 U1.B7 U1.B8 U1.B11 U1.B14 U1.B15 U1.B18 U1.B19 U1.B21 U1.B24 U1.B27 U1.B30 U1.B33 U1.B36 U1.B39 U1.C1 U1.C4 U1.C7 U1.C10 U1.C13 U1.C14 U1.C17 U1.C21 U1.C24 U1.C27 U1.C30 U1.C33 U1.C36 U1.C39 U1.D3 U1.D6 U1.D7 U1.D8 U1.D11 U1.D14 U1.D15 U1.D18 U1.D19 U1.D21 U1.D24 U1.D27 U1.D30 U1.D33 U1.D36 U1.D39 U1.E1 U1.E2 U1.E3 U1.E4 U1.E5 U1.E6 U1.E8 U1.E9 U1.E10 U1.E11 U1.E12 U1.E13 U1.E14 U1.E15 U1.E16 U1.E17 U1.E19 U1.E21 U1.E24 U1.E27 U1.E30 U1.E33 U1.E36 U1.E39 U1.F1 U1.F2 U1.F3 U1.F4 U1.F5 U1.F6 U1.F8 U1.F9 U1.F10 U1.F11 U1.F12 U1.F13 U1.F14 U1.F15 U1.F16 U1.F17 U1.F19 U1.F21 U1.F24 U1.F27 U1.F30 U1.F33 U1.F36 U1.F39 U1.G3 U1.G6 U1.G7 U1.G8 U1.G11 U1.G14 U1.G15 U1.G18 U1.G19 U1.G21 U1.G24 U1.G27 U1.G30 U1.G33 U1.G36 U1.G39 U1.H1 U1.H4 U1.H7 U1.H10 U1.H13 U1.H14 U1.H17 U1.H19 U1.H21 U1.H24 U1.H27 U1.H30 U1.H33 U1.H36 U1.H39 U1.J3 U1.J6 U1.J8 U1.J11 U1.J14 U1.J15 U1.J18 U1.J19 U1.J21 U1.J24 U1.J27 U1.J30 U1.J33 U1.J36 U1.J39 U1.K1 U1.K4 U1.K7 U1.K10 U1.K13 U1.K14 U1.K17 U1.K19 U1.K21 U1.K24 U1.K27 U1.K30 U1.K33 U1.K36 U2.7 U2.8 U2.9 U2.10 U2.11 U2.12 U107.3 U107.4 U108.2 U109.2 U110.2 U111.2 U112.1
ADJ: U107.6
CLK+: F1.A13 U1.F7
CLK-: F1.A14 U1.E7
I2CADDR0: R3.1 U1.H18
I2CADDR1: R2.1 U1.C18
JTAG_SEL: U1.C19
JTAG_TCLK: U1.C20
JTAG_TDI: U1.E20
JTAG_TDO: U1.D20
JTAG_TMS: U1.B20
JTAG_TRST#: U1.A20
PCIET0+: C61.1 F1.A16
PCIET0-: C62.1 F1.A17
PCIET1+: C1.1 F1.A21
PCIET1-: C2.1 F1.A22
PCIET2+: C3.1 F1.A25
PCIET2-: C4.1 F1.A26
PCIET3+: C5.1 F1.A29
PCIET3-: C6.1 F1.A30
PCIET4+: C7.1 F1.A35
PCIET4-: C8.1 F1.A36
PCIET5+: C9.1 F1.A39
PCIET5-: C10.1 F1.A40
PCIET6+: C11.1 F1.A43
PCIET6-: C12.1 F1.A44
PCIET7+: C13.1 F1.A47
PCIET7-: C14.1 F1.A48
PCIET8+: C15.1 F1.A52
PCIET8-: C16.1 F1.A53
PCIET9+: C17.1 F1.A56
PCIET9-: C18.1 F1.A57
PCIET10+: C19.1 F1.A60
PCIET10-: C20.1 F1.A61
PCIET11+: C21.1 F1.A64
PCIET11-: C22.1 F1.A65
PCIET12+: C23.1 F1.A68
PCIET12-: C24.1 F1.A69
PCIET13+: C25.1 F1.A72
PCIET13-: C26.1 F1.A73
PCIET14+: C27.1 F1.A76
PCIET14-: C28.1 F1.A77
PCIET15+: C29.1 F1.A80
PCIET15-: C30.1 F1.A81
PERST#: F1.A11 U1.F18
PRSNT1: F1.A1 R4.1
PRSNT2: F1.B81 R4.2
PRSNT2#_SXM: U1.J7
PWR_BRAKE#: U1.E18
PWR_EN: H2.2 U1.A18
PWR_GOOD: U1.K18
RX0+: F1.B14 U1.D13
RX0-: F1.B15 U1.D12
RX1+: F1.B19 U1.B13
RX1-: F1.B20 U1.B12
RX2+: F1.B23 U1.A12
RX2-: F1.B24 U1.A11
RX3+: F1.B27 U1.C12
RX3-: F1.B28 U1.C11
RX4+: F1.B33 U1.B10
RX4-: F1.B34 U1.B9
RX5+: F1.B37 U1.A9
RX5-: F1.B38 U1.A8
RX6+: F1.B41 U1.C9
RX6-: F1.B42 U1.C8
RX7+: F1.B45 U1.D10
RX7-: F1.B46 U1.D9
RX8+: F1.B50 U1.C6
RX8-: F1.B51 U1.C5
RX9+: F1.B54 U1.A6
RX9-: F1.B55 U1.A5
RX10+: F1.B58 U1.B5
RX10-: F1.B59 U1.B4
RX11+: F1.B62 U1.D5
RX11-: F1.B63 U1.D4
RX12+: F1.B66 U1.A3
RX12-: F1.B67 U1.A2
RX13+: F1.B70 U1.B2
RX13-: F1.B71 U1.B1
RX14+: F1.B74 U1.C3
RX14-: F1.B75 U1.C2
RX15+: F1.B78 U1.D2
RX15-: F1.B79 U1.D1
SXM_PRSNT2: U1.K39
THERM_OVER#: H1.2 U1.A19
TX0+: C61.2 U1.J13
TX0-: C62.2 U1.J12
TX1+: C1.2 U1.G13
TX1-: C2.2 U1.G12
TX2+: C3.2 U1.H12
TX2-: C4.2 U1.H11
TX3+: C5.2 U1.K12
TX3-: C6.2 U1.K11
TX4+: C7.2 U1.G10
TX4-: C8.2 U1.G9
TX5+: C9.2 U1.H9
TX5-: C10.2 U1.H8
TX6+: C11.2 U1.J10
TX6-: C12.2 U1.J9
TX7+: C13.2 U1.K9
TX7-: C14.2 U1.K8
TX8+: C15.2 U1.K6
TX8-: C16.2 U1.K5
TX9+: C17.2 U1.H6
TX9-: C18.2 U1.H5
TX10+: C19.2 U1.G5
TX10-: C20.2 U1.G4
TX11+: C21.2 U1.J5
TX11-: C22.2 U1.J4
TX12+: C23.2 U1.H3
TX12-: C24.2 U1.H2
TX13+: C25.2 U1.G2
TX13-: C26.2 U1.G1
TX14+: C27.2 U1.J2
TX14-: C28.2 U1.J1
TX15+: C29.2 U1.K3
TX15-: C30.2 U1.K2

Pads without a net: C90 2; C93 1 2; F1 A5 A6 A7 A8 A19 A32 A33 A50 B5 B6 B9 B10 B11 B12 B17 B30 B31 B48 B82; J54 MH1 MH2 MH3 MH4 MH5 MH6 MH7 MH8 MH9 MH10; NOREF 3; NOREF#2 1; NOREF#3 3; NOREF#4 1; NOREF#5 1; NOREF#6 3; NOREF#7 3; NOREF#8 3; NOREF#9 3; NOREF#10 3; NOREF#11 3; R1 1 2; U1 A15 A16 B16 B17 C15 C16 D16 D17 G16 G17 H15 H16 J16 J17 K15 K16; U2 s1 s2 s3 s4; U107 1

## Via types
v1: diameter 0.45, hole 0.299, Top Layer to Bottom Layer, 1132 vias
v2: diameter 0.381, hole 0.254, Top Layer to Bottom Layer, 32 vias

## Routing (per net, layer and track width the routed paths; a pad name or vN(x,y) marks a point on that pad's centre or on a via; arc(x,y) is an arc through that point)
+5V: length 10.2
  Top Layer w0.254: U112.3 212.53,67 arc(211.98,67.83) 211.78,68.8 C92.1 211.78,72.93 arc(211.98,73.9) 212.53,74.72 v1(213.49,75.69)
  vias: v1(138.56,61.21) v1(139.83,61.21) v1(141.1,61.21) v1(142.37,61.21) v1(143.64,61.21) v1(205.49,75.75) v1(205.49,75.12) v1(205.49,74.48) v1(205.49,73.85) v1(205.49,73.21) v1(205.49,72.58) v1(206.25,75.75) v1(206.25,75.12) v1(206.25,74.48) v1(206.25,73.85) v1(206.25,73.21) v1(206.25,72.58) v1(210.03,75.77)
+12V: length 148.6
  Top Layer w0.508: U1.A32 U1.B32 U1.C32 U1.D32 v1(137.29,76.45) v1(138.56,76.45) U1.G32 U1.J32 v1(143.64,76.45) ; v1(143.64,86.61) U1.J40 U1.G40 v1(138.56,86.61) v1(137.29,86.61) U1.D40 U1.C40 U1.B40 v1(132.21,86.61) ; v1(132.21,80.26) v1(137.29,80.26) v1(138.56,80.26) v1(143.64,80.26) ; v1(143.64,84.07) U1.J38 U1.G38 v1(138.56,84.07) v1(137.29,84.07) U1.D38 U1.C38 U1.B38 v1(132.21,84.07) ; v1(132.21,65.02) U1.B23 U1.C23 U1.D23 v1(137.29,65.02) v1(138.56,65.02) U1.G23 U1.J23 v1(143.64,65.02) ; v1(132.21,63.75) U1.B22 U1.C22 U1.D22 v1(137.29,63.75) v1(138.56,63.75) U1.G22 U1.J22 v1(143.64,63.75) ; v1(143.64,71.37) U1.J28 U1.G28 v1(138.56,71.37) v1(137.29,71.37) U1.D28 U1.C28 U1.B28 v1(132.21,71.37) ; U1.A26 U1.B26 U1.C26 U1.D26 v1(137.29,68.83) v1(138.56,68.83) U1.G26 U1.J26 v1(143.64,68.83) ; v1(132.21,78.99) U1.B34 U1.C34 U1.D34 v1(137.29,78.99) v1(138.56,78.99) U1.G34 U1.J34 v1(143.64,78.99) ; v1(143.64,67.56) U1.J25 U1.G25 v1(138.56,67.56) v1(137.29,67.56) U1.D25 U1.C25 U1.B25 v1(132.21,67.56) ; v1(132.21,72.64) U1.B29 U1.C29 U1.D29 v1(137.29,72.64) v1(138.56,72.64) U1.G29 U1.J29 v1(143.64,72.64) ; v1(132.21,75.18) U1.B31 U1.C31 U1.D31 v1(137.29,75.18) v1(138.56,75.18) U1.G31 U1.J31 v1(143.64,75.18) ; v1(132.21,82.8) U1.B37 U1.C37 U1.D37 v1(137.29,82.8) v1(138.56,82.8) U1.G37 U1.J37 v1(143.64,82.8)
  vias: v1(46.23,10.16) v1(46.23,9.39) v1(46.23,8.63) v1(46.22,7.89) v1(46.22,7.17) v1(46.74,6.6) v1(47.13,10.16) v1(47.12,9.39) v1(47.13,8.63) v1(47.13,7.89) v1(47.13,7.17) v1(48.01,12.82) v1(48.01,11.75) v1(48.77,15.74) v1(48.77,15.09) v1(132.21,76.46) v1(132.2,68.83) v1(194.75,97.66) v1(195.66,106.41) v1(195.66,105.4) v1(195.66,104.45) v1(195.73,97.66) v1(196.6,97.66) v1(198.8,101.98) v1(199.88,101.98) v1(199.95,95.53) v1(199.95,94.56) v1(199.95,93.45) v1(200.77,101.98) v1(205.62,86.48) v1(205.62,85.85) v1(205.62,85.21) v1(205.62,84.58) v1(205.62,83.94) v1(205.62,83.31) v1(206,86.99) v1(206,82.8) v1(206.38,86.48) v1(206.38,85.85) v1(206.38,85.21) v1(206.38,84.58) v1(206.38,83.94) v1(206.38,83.31) v1(215.38,97.15) v1(216.31,97.15) v1(216.49,105.72) v1(216.49,104.82) v1(216.49,103.84) v1(217.16,97.15) v1(218.7,101.72) v1(219.69,101.72) v1(220.02,95.39) v1(220.02,94.44) v1(220.02,93.52) v1(220.59,101.72)
GND: length 136.8
  Top Layer w0.115: v1(138.56,48.88) U1.F10 ; 141.1,52.32 141.1,53.59 ; v1(138.54,52.94) arc(138.56,52.92) 138.56,52.9
  Top Layer w0.254: U1.F17 U1.G18 U1.G19 ; U1.F17 v1(138.56,56.13) U1.F15 U1.G15 U1.G14 U1.J14 ; U1.F17 U1.E17 U1.E16 ; U1.J14 U1.J15 ; U1.J14 U1.K14 ; U1.J19 U1.G19 ; U1.J19 U1.J18 U1.K17 ; U1.J19 U1.K19 ; U1.G19 U1.F19 ; U1.D7 U1.D6 ; U1.D7 v1(136.02,45.97) ; U1.D7 U1.C7 U1.B7 ; U1.G7 U1.F8 U1.F9 U1.F10 ; U1.F14 U1.F13 U1.F12 U1.F11 v1(138.56,48.88) ; U1.B7 U1.B8 ; U1.B7 U1.A7 ; U1.B7 U1.B6 ; 141.1,40.89 v1(142.37,39.62) ; U1.J11 v1(141.1,48.51) ; U1.E8 U1.E9 U1.E10 U1.E11 U1.E12 U1.E13 v1(137.29,52.94) U1.E14 U1.D14
  Top Layer w0.508: U1.K21 U1.J21 U1.G21 U1.F21 U1.E21 U1.D21 U1.C21 U1.B21 U1.A21 ; U1.A33 U1.B33 U1.C33 U1.D33 U1.E33 U1.F33 U1.G33 U1.J33 U1.K33 ; U1.K36 U1.J36 U1.G36 v1(138.56,81.53) v1(137.29,81.53) U1.D36 U1.C36 U1.B36 U1.A36 ; U1.A24 U1.B24 U1.C24 U1.D24 U1.E24 U1.F24 U1.G24 U1.J24 U1.K24 ; U1.A39 U1.B39 U1.C39 U1.D39 U1.E39 U1.F39 U1.G39 U1.J39 ; U1.K30 U1.J30 U1.G30 U1.F30 U1.E30 U1.D30 U1.C30 U1.B30 U1.A30 ; U1.K27 U1.J27 U1.G27 U1.F27 U1.E27 U1.D27 U1.C27 U1.B27 U1.A27
  Inner4 w0.13: 58.42,9.9 59.52,8.81 arc(59.65,8.61) 59.69,8.38
  vias: v1(5.44,116.62) v1(5.44,111.54) v1(5.44,106.46) v1(5.44,101.38) v1(5.44,96.3) v1(5.44,86.14) v1(5.44,81.06) v1(5.44,75.98) v1(5.44,70.9) v1(5.44,65.82) v1(5.44,60.74) v1(5.44,55.66) v1(5.44,50.58) v1(5.44,45.5) v1(5.44,40.42) v1(5.44,35.34) v1(5.44,30.26) v1(5.44,25.18) v1(5.44,20.1) v1(5.44,15.02) v1(10.52,121.7) v1(10.52,116.62) v1(10.52,111.54) v1(10.52,106.46) v1(10.52,101.38) v1(10.52,96.3) v1(10.52,91.22) v1(10.52,86.14) v1(10.52,81.06) v1(10.52,75.98) v1(10.52,70.9) v1(10.52,60.74) v1(10.52,55.66) v1(10.52,50.58) v1(10.52,45.5) v1(10.52,40.42) v1(10.52,35.34) v1(10.52,30.26) v1(10.52,25.18) v1(10.52,20.1) v1(10.52,15.02) v1(10.52,9.94) v1(15.6,121.7) v1(15.6,116.62) v1(15.6,111.54) v1(15.6,106.46) v1(15.6,101.38) v1(15.6,96.3) v1(15.6,91.22) v1(15.6,86.14) v1(15.6,81.06) v1(15.6,75.98) v1(15.6,70.9) v1(15.6,65.82) v1(15.6,60.74) v1(15.6,55.66) v1(15.6,50.58) v1(15.6,45.5) v1(15.6,40.42) v1(15.6,35.34) v1(15.6,30.26) v1(15.6,25.18) v1(15.6,20.1) v1(15.6,15.02) v1(20.68,121.7) v1(20.68,116.62) v1(20.68,111.54) v1(20.68,106.46) v1(20.68,101.38) v1(20.68,96.3) v1(20.68,91.22) v1(20.68,86.14) v1(20.68,81.06) v1(20.68,75.98) v1(20.68,70.9) v1(20.68,65.82) v1(20.68,60.74) v1(20.68,55.66) v1(20.68,50.58) v1(20.68,45.5) v1(20.68,40.42) v1(20.68,35.34) v1(20.68,30.26) v1(20.68,25.18) v1(20.68,20.1) v1(25.76,116.62) v1(25.76,111.54) v1(25.76,106.46) v1(25.76,101.38) v1(25.76,96.3) v1(25.76,91.22) v1(25.76,86.14) v1(25.76,81.06) v1(25.76,75.98) v1(25.76,70.9) v1(25.76,65.82) v1(25.76,60.74) v1(25.76,55.66) v1(25.76,50.58) v1(25.76,45.5) v1(25.76,40.42) v1(25.76,35.34) v1(25.76,30.26) v1(25.76,25.18) v1(25.76,20.1) v1(25.76,15.02) v1(30.84,116.62) v1(30.84,111.54) v1(30.84,106.46) v1(30.84,101.38) v1(30.84,96.3) v1(30.84,91.22) v1(30.84,86.14) v1(30.84,81.06) v1(30.84,75.98) v1(30.84,70.9) v1(30.84,65.82) v1(30.84,60.74) v1(30.84,55.66) v1(30.84,50.58) v1(30.84,45.5) v1(30.84,40.42) v1(30.84,35.34) v1(30.84,30.26) v1(30.84,25.18) v1(30.84,20.1) v1(30.84,15.02) v1(35.92,121.7) v1(35.92,116.62) v1(35.92,111.54) v1(35.92,106.46) v1(35.92,101.38) v1(35.92,96.3) v1(35.92,91.22) v1(35.92,86.14) v1(35.92,81.06) v1(35.92,75.98) v1(35.92,70.9) v1(35.92,65.82) v1(35.92,60.74) v1(35.92,55.66) v1(35.92,50.58) v1(35.92,45.5) v1(35.92,40.42) v1(35.92,35.34) v1(35.92,30.26) v1(35.92,25.18) v1(35.92,20.1) v1(35.92,15.02) v1(41,121.7) v1(41,116.62) v1(41,111.54) v1(41,106.46) v1(41,101.38) v1(41,91.22) v1(41,86.14) v1(41,81.06) v1(41,75.98) v1(41,70.9) v1(41,65.82) v1(41,60.74) v1(41,50.58) v1(41,45.5) v1(41,40.42) v1(41,35.34) v1(41,30.26) v1(41,25.18) v1(41,20.1) v1(41,15.02) v1(46.08,121.7) v1(46.08,116.62) v1(46.08,111.54) v1(46.08,106.46) v1(46.08,101.38) v1(46.08,96.3) v1(46.08,91.22) v1(46.08,86.14) v1(46.08,81.06) v1(46.08,75.98) v1(46.08,70.9) v1(46.08,65.82) v1(46.08,60.74) v1(46.08,55.66) v1(46.08,50.58) v1(46.08,45.5) v1(46.08,40.42) v1(46.08,35.34) v1(46.08,30.26) v1(46.08,25.18) v1(46.08,20.1) v1(46.08,15.02) v1(51.16,121.7) v1(51.16,116.62) v1(51.16,111.54) v1(51.16,106.46) v1(51.16,101.38) v1(51.16,96.3) v1(51.16,91.22) v1(51.16,86.14) v1(51.16,81.06) v1(51.16,75.98) v1(51.16,70.9) v1(51.16,65.82) v1(51.16,60.74) v1(51.16,55.66) v1(51.16,50.58) v1(51.16,45.5) v1(51.16,40.42) v1(51.16,35.34) v1(51.16,30.26) v1(51.16,25.18) v1(51.16,20.1) v1(51.16,15.02) v1(51.16,9.94) v1(56.24,121.7) v1(56.24,116.62) v1(56.24,111.54) v1(56.24,106.46) v1(56.24,101.38) v1(56.24,96.3) v1(56.24,91.22) v1(56.24,86.14) v1(56.24,81.06) v1(56.24,75.98) v1(56.24,70.9) v1(56.24,65.82) v1(56.24,60.74) v1(56.24,55.66) v1(56.24,50.58) v1(56.24,45.5) v1(56.24,40.42) v1(56.24,35.34) v1(56.24,30.26) v1(56.24,15.02) v1(56.24,9.94) v1(61.32,121.7) v1(61.32,116.62) v1(61.32,111.54) v1(61.32,106.46) v1(61.32,101.38) v1(61.32,96.3) v1(61.32,91.22) v1(61.32,86.14) v1(61.32,81.06) v1(61.32,75.98) v1(61.32,70.9) v1(61.32,65.82) v1(61.32,60.74) v1(61.32,55.66) v1(61.32,50.58) v1(61.32,45.5) v1(61.32,40.42) v1(61.32,35.34) v1(61.32,30.26) v1(62.36,6.29) v1(64.9,6.29) v1(66.4,121.7) v1(66.4,116.62) v1(66.4,111.54) v1(66.4,106.46) v1(66.4,101.38) v1(66.4,96.3) v1(66.4,91.22) v1(66.4,86.14) v1(66.4,81.06) v1(66.4,75.98) v1(66.4,70.9) v1(66.4,65.82) v1(66.4,60.74) v1(66.4,55.66) v1(66.4,50.58) v1(66.4,45.5) v1(66.4,40.42) v1(67.34,6.29) v1(68.97,6.29) v1(71.35,6.29) v1(71.48,121.7) v1(71.48,116.62) v1(71.48,111.54) v1(71.48,106.46) v1(71.48,101.38) v1(71.48,91.22) v1(71.48,86.14) v1(71.48,81.06) v1(71.48,75.98) v1(71.48,70.9) v1(71.48,65.82) v1(71.48,60.74) v1(71.48,55.66) v1(71.48,50.58) v1(71.48,45.5) v1(72.99,6.29) v1(75.37,6.29) v1(76.56,121.7) v1(76.56,116.62) v1(76.56,111.54) v1(76.56,106.46) v1(76.56,101.38) v1(76.56,96.3) v1(76.56,91.22) v1(76.56,86.14) v1(76.56,81.06) v1(76.56,75.98) v1(76.56,70.9) v1(76.56,65.82) v1(76.56,60.74) v1(76.56,55.66) v1(76.56,50.58) v1(76.56,45.5) v1(77.09,6.29) v1(79,6.29) v1(81.32,6.29) v1(81.64,121.7) v1(81.64,116.62) v1(81.64,111.54) v1(81.64,106.46) v1(81.64,101.38) v1(81.64,96.3) v1(81.64,91.22) v1(81.64,86.14) v1(81.64,81.06) v1(81.64,75.98) v1(81.64,70.9) v1(81.64,65.82) v1(81.64,60.74) v1(81.64,55.66) v1(81.64,50.58) v1(82.98,6.29) v1(85.18,6.29) v1(86.72,121.7) v1(86.72,116.62) v1(86.72,111.54) v1(86.72,106.46) v1(86.72,101.38) v1(86.72,96.3) v1(86.72,91.22) v1(86.72,86.14) v1(86.72,81.06) v1(86.72,75.98) v1(86.72,70.9) v1(86.72,65.82) v1(86.72,60.74) v1(86.72,55.66) v1(86.72,50.58) v1(86.98,6.29) v1(89.33,6.29) v1(90.96,6.29) v1(91.8,121.7) v1(91.8,116.62) v1(91.8,111.54) v1(91.8,106.46) v1(91.8,101.38) v1(91.8,96.3) v1(91.8,91.22) v1(91.8,86.14) v1(91.8,81.06) v1(91.8,75.98) v1(91.8,70.9) v1(91.8,65.82) v1(91.8,60.74) v1(91.8,55.66) v1(91.8,50.58) v1(93.22,6.29) v1(95.96,6.29) v1(96.88,121.7) v1(96.88,116.62) v1(96.88,111.54) v1(96.88,106.46) v1(96.88,101.38) v1(96.88,96.3) v1(96.88,91.22) v1(96.88,86.14) v1(96.88,81.06) v1(96.88,75.98) v1(96.88,70.9) v1(96.88,65.82) v1(96.88,60.74) v1(96.88,55.66) v1(98.32,6.29) v1(99.97,6.29) v1(101.96,121.7) v1(101.96,116.62) v1(101.96,111.54) v1(101.96,106.46) v1(101.96,101.38) v1(101.96,96.3) v1(101.96,91.22) v1(101.96,86.14) v1(101.96,81.06) v1(101.96,75.98) v1(101.96,70.9) v1(101.96,65.82) v1(101.96,60.74) v1(101.96,55.66) v1(102.31,6.29) v1(103.98,6.29) v1(106.23,6.29) v1(107.04,111.54) v1(107.04,106.46) v1(107.04,101.38) v1(107.04,96.3) v1(107.04,91.22) v1(107.04,86.14) v1(107.04,81.06) v1(107.04,75.98) v1(107.04,70.9) v1(107.04,65.82) v1(107.04,60.74) v1(107.04,55.66) v1(107.98,6.29) v1(110.34,6.29) v1(111.96,6.29) v1(112.12,121.7) v1(112.12,116.62) v1(112.12,111.54) v1(112.12,106.46) v1(112.12,101.38) v1(112.12,96.3) v1(112.12,91.22) v1(112.12,86.14) v1(112.12,81.06) v1(112.12,75.98) v1(112.12,70.9) v1(112.12,65.82) v1(112.12,60.74) v1(112.12,55.66) v1(114.24,6.29) v1(115.97,6.29) v1(117.2,121.7) v1(117.2,116.62) v1(117.2,111.54) v1(117.2,106.46) v1(117.2,101.38) v1(117.2,96.3) v1(117.2,91.22) v1(117.2,86.14) v1(117.2,81.06) v1(117.2,75.98) v1(117.2,70.9) v1(117.2,65.82) v1(117.2,60.74) v1(118.19,6.29) v1(120.07,6.29) v1(122.28,121.7) v1(122.28,116.62) v1(122.28,111.54) v1(122.28,106.46) v1(122.28,101.38) v1(122.28,96.3) v1(122.28,91.22) v1(122.28,86.14) v1(122.28,81.06) v1(122.28,75.98) v1(122.28,70.9) v1(122.28,65.82) v1(122.28,60.74) v1(122.34,6.29) v1(123.97,6.29) v1(126.19,6.29) v1(127.36,121.7) v1(127.36,116.62) v1(127.36,111.54) v1(127.36,106.46) v1(127.36,101.38) v1(127.36,96.3) v1(127.36,91.22) v1(127.36,86.14) v1(127.36,81.06) v1(127.36,75.98) v1(127.36,70.9) v1(127.36,65.82) v1(127.36,60.74) v1(127.36,20.1) v1(128.15,6.35) v1(132.21,40.52) v1(132.44,121.7) v1(132.44,116.62) v1(132.44,111.54) v1(132.44,106.46) v1(132.44,101.38) v1(132.44,96.3) v1(132.44,91.22) v1(132.44,25.18) v1(132.44,20.1) v1(132.44,15.02) v1(132.44,9.94) v1(133.48,39.21) v1(136.02,54.86) v1(137.29,59.94) v1(137.29,54.86) v1(137.29,48.88) v1(137.29,47.71) v1(137.29,43.12) v1(137.52,121.7) v1(137.52,116.62) v1(137.52,111.54) v1(137.52,106.46) v1(137.52,101.38) v1(137.52,91.22) v1(137.52,30.26) v1(137.52,20.1) v1(137.52,15.02) v1(137.52,9.94) v1(138.56,47.71) v1(138.55,43.12) v1(139.83,45.97) v1(142.6,121.7) v1(142.6,116.62) v1(142.6,111.54) v1(142.6,106.46) v1(142.6,101.38) v1(142.6,96.3) v1(142.6,91.22) v1(142.6,35.34) v1(142.6,30.26) v1(142.6,20.1) v1(142.6,15.02) v1(143.9,44.7) v1(143.9,40.86) v1(144.02,37.04) v1(147.68,121.7) v1(147.68,116.62) v1(147.68,111.54) v1(147.68,106.46) v1(147.68,101.38) v1(147.68,96.3) v1(147.68,91.22) v1(147.68,86.14) v1(147.68,81.06) v1(147.68,75.98) v1(147.68,70.9) v1(147.68,65.82) v1(147.68,60.74) v1(147.68,55.66) v1(147.68,50.58) v1(147.68,45.5) v1(147.68,40.42) v1(147.68,35.34) v1(147.68,30.26) v1(147.68,25.18) v1(147.68,20.1) v1(147.68,15.02) v1(152.76,121.7) v1(152.76,116.62) v1(152.76,111.54) v1(152.76,106.46) v1(152.76,101.38) v1(152.76,96.3) v1(152.76,91.22) v1(152.76,86.14) v1(152.76,81.06) v1(152.76,75.98) v1(152.76,70.9) v1(152.76,65.82) v1(152.76,60.74) v1(152.76,55.66) v1(152.76,50.58) v1(152.76,45.5) v1(152.76,40.42) v1(152.76,35.34) v1(152.76,30.26) v1(152.76,25.18) v1(152.76,20.1) v1(152.76,15.02) v1(157.84,121.7) v1(157.84,116.62) v1(157.84,111.54) v1(157.84,106.46) v1(157.84,101.38) v1(157.84,96.3) v1(157.84,91.22) v1(157.84,86.14) v1(157.84,81.06) v1(157.84,75.98) v1(157.84,70.9) v1(157.84,65.82) v1(157.84,60.74) v1(157.84,55.66) v1(157.84,50.58) v1(157.84,45.5) v1(157.84,40.42) v1(157.84,35.34) v1(157.84,30.26) v1(157.84,25.18) v1(157.84,20.1) v1(157.84,15.02) v1(162.92,121.7) v1(162.92,116.62) v1(162.92,111.54) v1(162.92,106.46) v1(162.92,101.38) v1(162.92,96.3) v1(162.92,91.22) v1(162.92,86.14) v1(162.92,81.06) v1(162.92,75.98) v1(162.92,70.9) v1(162.92,65.82) v1(162.92,60.74) v1(162.92,55.66) v1(162.92,50.58) v1(162.92,45.5) v1(162.92,40.42) v1(162.92,35.34) v1(162.92,30.26) v1(162.92,25.18) v1(162.92,20.1) v1(168,121.7) v1(168,116.62) v1(168,111.54) v1(168,106.46) v1(168,101.38) v1(168,96.3) v1(168,91.22) v1(168,86.14) v1(168,81.06) v1(168,75.98) v1(168,70.9) v1(168,65.82) v1(168,60.74) v1(168,50.58) v1(168,45.5) v1(168,40.42) v1(168,35.34) v1(168,30.26) v1(168,25.18) v1(168,20.1) v1(168,15.02) v1(173.08,121.7) v1(173.08,116.62) v1(173.08,111.54) v1(173.08,106.46) v1(173.08,101.38) v1(173.08,91.22) v1(173.08,86.14) v1(173.08,81.06) v1(173.08,75.98) v1(173.08,70.9) v1(173.08,65.82) v1(173.08,60.74) v1(173.08,55.66) v1(173.08,50.58) v1(173.08,45.5) v1(173.08,40.42) v1(173.08,35.34) v1(173.08,30.26) v1(173.08,25.18) v1(173.08,20.1) v1(173.08,15.02) v1(178.16,121.7) v1(178.16,116.62) v1(178.16,111.54) v1(178.16,106.46) v1(178.16,101.38) v1(178.16,96.3) v1(178.16,91.22) v1(178.16,86.14) v1(178.16,81.06) v1(178.16,75.98) v1(178.16,70.9) v1(178.16,65.82) v1(178.16,60.74) v1(178.16,55.66) v1(178.16,50.58) v1(178.16,45.5) v1(178.16,40.42) v1(178.16,35.34) v1(178.16,30.26) v1(178.16,25.18) v1(178.16,20.1) v1(183.24,111.54) v1(183.24,106.46) v1(183.24,101.38) v1(183.24,96.3) v1(183.24,91.22) v1(183.24,86.14) v1(183.24,81.06) v1(183.24,75.98) v1(183.24,70.9) v1(183.24,65.82) v1(183.24,60.74) v1(183.24,55.66) v1(183.24,50.58) v1(183.24,45.5) v1(183.24,40.42) v1(183.24,35.34) v1(183.24,30.26) v1(183.24,25.18) v1(183.24,20.1) v1(183.24,15.02) v1(188.32,116.62) v1(188.32,111.54) v1(188.32,101.38) v1(188.32,96.3) v1(188.32,91.22) v1(188.32,86.14) v1(188.32,81.06) v1(188.32,75.98) v1(188.32,70.9) v1(188.32,65.82) v1(188.32,60.74) v1(188.32,55.66) v1(188.32,50.58) v1(188.32,45.5) v1(188.32,40.42) v1(188.32,35.34) v1(188.32,30.26) v1(188.32,25.18) v1(188.32,20.1) v1(188.32,15.02) v1(193.4,111.54) v1(193.4,106.46) v1(193.4,101.38) v1(193.4,96.3) v1(193.4,91.22) v1(193.4,86.14) v1(193.4,81.06) v1(193.4,75.98) v1(193.4,70.9) v1(193.4,65.82) v1(193.4,60.74) v1(193.4,55.66) v1(193.4,50.58) v1(193.4,45.5) v1(193.4,40.42) v1(193.4,35.34) v1(193.4,30.26) v1(193.4,25.18) v1(193.4,20.1) v1(193.4,15.02) v1(198.48,111.54) v1(198.48,106.46) v1(198.48,91.22) v1(198.48,86.14) v1(198.48,81.06) v1(198.48,75.98) v1(198.48,70.9) v1(198.48,65.82) v1(198.48,60.74) v1(198.48,55.66) v1(198.48,50.58) v1(198.48,45.5) v1(198.48,40.42) v1(198.48,35.34) v1(198.48,30.26) v1(198.48,25.18) v1(198.48,20.1) v1(198.48,15.02) v1(203.56,111.54) v1(203.56,106.46) v1(203.56,101.38) v1(203.56,96.3) v1(203.56,91.22) v1(203.56,86.14) v1(203.56,81.06) v1(203.56,75.98) v1(203.56,70.9) v1(203.56,65.82) v1(203.56,60.74) v1(203.56,55.66) v1(203.56,50.58) v1(203.56,45.5) v1(203.56,40.42) v1(203.56,35.34) v1(203.56,30.26) v1(203.56,25.18) v1(203.56,20.1) v1(203.56,15.02) v1(208.64,121.7) v1(208.64,116.62) v1(208.64,111.54) v1(208.64,106.46) v1(208.64,101.38) v1(208.64,91.22) v1(208.64,81.06) v1(208.64,70.9) v1(208.64,65.82) v1(208.64,60.74) v1(208.64,55.66) v1(208.64,50.58) v1(208.64,45.5) v1(208.64,40.42) v1(208.64,35.34) v1(208.64,30.26) v1(208.64,25.18) v1(208.64,20.1) v1(208.64,15.02) v1(213.72,121.7) v1(213.72,116.62) v1(213.72,111.54) v1(213.72,106.46) v1(213.72,101.38) v1(213.72,96.3) v1(213.72,91.22) v1(213.72,81.06) v1(213.72,70.9) v1(213.72,60.74) v1(213.72,55.66) v1(213.72,50.58) v1(213.72,45.5) v1(213.72,40.42) v1(213.72,35.34) v1(213.72,30.26) v1(213.72,25.18) v1(213.72,20.1) v1(213.72,15.02) v1(216.01,66.52) v1(218.8,121.7) v1(218.8,116.62) v1(218.8,111.54) v1(218.8,106.46) v1(218.8,91.22) v1(218.8,70.9) v1(218.8,55.66) v1(218.8,50.58) v1(218.8,45.5) v1(218.8,40.42) v1(218.8,35.34) v1(218.8,30.26) v1(218.8,25.18) v1(218.8,20.1) v1(218.8,15.02) v1(223.88,116.62) v1(223.88,111.54) v1(223.88,106.46) v1(223.88,96.3) v1(223.88,91.22) v1(223.88,86.14) v1(223.88,70.9) v1(223.88,60.74) v1(223.88,55.66) v1(223.88,50.58) v1(223.88,45.5) v1(223.88,40.42) v1(223.88,35.34) v1(223.88,30.26) v1(223.88,25.18) v1(223.88,20.1) v1(228.96,116.62) v1(228.96,111.54) v1(228.96,106.46) v1(228.96,101.38) v1(228.96,96.3) v1(228.96,91.22) v1(228.96,86.14) v1(228.96,81.06) v1(228.96,75.98) v1(228.96,70.9) v1(228.96,65.82) v1(228.96,60.74) v1(228.96,55.66) v1(228.96,50.58) v1(228.96,45.5) v1(228.96,40.42) v1(228.96,35.34) v1(228.96,30.26) v1(228.96,25.18) v1(228.96,20.1) v1(228.96,15.02) v2(61.13,5.8) v2(63.14,5.79) v2(66.14,5.78) v2(68.14,5.84) v2(70.15,5.78) v2(72.14,5.84) v2(74.15,5.8) v2(76.14,5.84) v2(80.15,5.8) v2(82.18,5.85) v2(84.15,5.8) v2(86.12,5.84) v2(88.15,5.8) v2(90.17,5.84) v2(92.14,5.8) v2(94.11,5.84) v2(97.14,5.79) v2(99.19,5.84) v2(101.14,5.79) v2(103.12,5.84) v2(105.15,5.8) v2(107.12,5.84) v2(109.15,5.8) v2(111.13,5.84) v2(113.14,5.79) v2(115.13,5.84) v2(117.15,5.8) v2(119.14,5.84) v2(121.15,5.8) v2(123.2,5.84) v2(125.15,5.8) v2(127.13,5.84)
CLK+: length 118.8
  Top Layer w0.115: v1(135.39,55.56) 137.04,55.56 arc(137.57,55.41) 137.93,54.99 arc(138.02,54.68) 138.03,54.35 138.03,45.97 arc(138.17,45.28) U1.F7
  Inner4 w0.115: v1(59.31,10.28) 59.31,10.52 arc(59.36,10.74) 59.49,10.93 59.57,11.02 arc(59.64,11.12) 59.66,11.23 59.66,11.36 arc(59.74,14.44) 59.98,17.52 59.98,17.53 60.08,20.95 arc(60.44,23.93) 61.35,26.79 arc(62.41,28.91) 63.76,30.86 arc(68.28,34.48) 73.92,35.81 arc(76.79,35.95) 79.63,36.32 arc(87.43,38.32) 94.79,41.57 arc(94.89,41.62) 94.99,41.68 111,50.41 arc(114.24,52.01) 117.61,53.34 arc(122.68,54.63) 127.89,55.06 134.19,55.06 arc(134.84,55.19) v1(135.39,55.56)
  Bottom Layer w0.115: F1.A13 arc(59.66,3.72) 59.66,3.73 59.66,9.45 arc(59.57,9.9) v1(59.31,10.28)
CLK-: length 118.7
  Top Layer w0.115: v1(135.39,54.35) 137.29,54.35 arc(137.61,54.25) 137.8,53.97 137.82,45.97 arc(137.68,45.28) U1.E7
  Inner4 w0.115: v1(60.22,10.28) 60.22,10.52 arc(60.18,10.74) 60.05,10.93 59.96,11.02 arc(59.9,11.12) 59.87,11.23 59.87,11.36 arc(59.95,14.44) 60.19,17.52 60.29,20.94 arc(60.65,23.88) 61.54,26.71 arc(62.6,28.8) 63.93,30.72 arc(68.37,34.29) 73.92,35.59 arc(76.81,35.73) 79.67,36.1 arc(87.5,38.11) 94.89,41.38 arc(94.99,41.43) 95.09,41.49 111.11,50.22 arc(114.33,51.81) 117.68,53.13 arc(122.71,54.42) 127.89,54.85 128.45,54.85 128.53,54.77 128.53,54.62 128.61,54.54 128.83,54.54 128.91,54.62 128.91,54.77 128.99,54.85 129.21,54.85 129.29,54.77 129.29,54.62 129.37,54.54 129.59,54.54 129.67,54.62 129.67,54.77 129.75,54.85 129.97,54.85 130.05,54.77 130.05,54.62 130.13,54.54 130.35,54.54 130.43,54.62 130.43,54.77 130.51,54.85 134.19,54.85 arc(134.84,54.72) v1(135.39,54.35)
  Bottom Layer w0.115: F1.A14 60.65,4.88 arc(60.53,5.47) 60.2,5.96 60.18,5.98 arc(59.95,6.32) 59.87,6.73 59.87,9.45 arc(59.96,9.9) v1(60.22,10.28)
I2CADDR0: length 0.6
  Top Layer w0.129: 141.1,58.67 140.78,58.34 arc(140.71,58.3) v1(140.64,58.29)
I2CADDR1: length 0.7
  Top Layer w0.129: U1.C18 135.04,58.38 arc(135.14,58.31) v1(135.26,58.29)
PCIET0+: length 5.2
  Bottom Layer w0.15: C61.1 62.62,8.49 arc(62.67,8.2) 62.84,7.95 arc(63,7.71) 63.06,7.42 63.06,6.68 arc(63.01,6.43) 62.87,6.22 arc(62.71,5.97) 62.65,5.69 F1.A16
PCIET0-: length 5.2
  Bottom Layer w0.15: F1.A17 63.65,5.87 arc(63.61,6.06) 63.5,6.22 arc(63.36,6.43) 63.31,6.68 63.31,7.42 arc(63.37,7.71) 63.54,7.95 arc(63.7,8.2) 63.76,8.49 C62.1
PCIET1+: length 5.2
  Bottom Layer w0.15: C1.1 67.57,8.49 arc(67.63,8.2) 67.79,7.95 arc(67.96,7.71) 68.01,7.42 68.01,6.73 arc(67.93,6.32) 67.7,5.96 arc(67.66,5.91) 67.65,5.85 F1.A21
PCIET1-: length 5.2
  Bottom Layer w0.15: F1.A22 68.65,5.81 arc(68.63,5.89) 68.58,5.96 arc(68.35,6.32) 68.27,6.73 68.27,7.42 arc(68.32,7.71) 68.49,7.95 arc(68.65,8.2) 68.71,8.49 C2.1
PCIET2+: length 5.2
  Bottom Layer w0.15: F1.A25 71.65,5.85 arc(71.66,5.92) 71.68,5.99 arc(71.71,6.03) 71.74,6.07 arc(71.94,6.38) 72.02,6.73 72.02,7.52 arc(71.96,7.77) 71.82,7.99 arc(71.68,8.2) 71.63,8.45 C3.1
PCIET2-: length 5.2
  Bottom Layer w0.15: C4.1 72.65,8.45 arc(72.6,8.2) 72.46,7.99 arc(72.32,7.77) 72.27,7.52 72.27,6.71 arc(72.33,6.37) 72.52,6.09 arc(72.62,5.95) 72.65,5.78 F1.A26
PCIET3+: length 5.2
  Bottom Layer w0.15: F1.A29 75.65,5.8 arc(75.66,5.89) 75.7,5.98 arc(75.73,6.02) 75.76,6.05 arc(75.95,6.34) 76.02,6.68 76.02,7.42 arc(75.96,7.71) 75.79,7.95 arc(75.63,8.2) 75.57,8.49 C5.1
PCIET3-: length 5.2
  Bottom Layer w0.15: C6.1 76.71,8.49 arc(76.65,8.2) 76.49,7.95 arc(76.32,7.71) 76.27,7.42 76.27,6.86 arc(76.35,6.44) 76.59,6.09 arc(76.63,6.02) 76.65,5.94 F1.A30
PCIET4+: length 5.2
  Bottom Layer w0.15: F1.A35 81.65,5.75 arc(81.69,5.93) 81.79,6.09 arc(81.98,6.37) 82.05,6.71 82.05,7.52 arc(82,7.77) 81.86,7.99 arc(81.72,8.2) 81.67,8.45 C7.1
PCIET4-: length 5.2
  Bottom Layer w0.15: F1.A36 82.65,5.86 arc(82.62,5.99) 82.55,6.09 arc(82.37,6.37) 82.3,6.71 82.3,7.52 arc(82.35,7.77) 82.49,7.99 arc(82.63,8.2) 82.68,8.45 C8.1
PCIET5+: length 5.2
  Bottom Layer w0.15: F1.A39 85.65,5.9 arc(85.67,6) 85.73,6.09 arc(85.92,6.37) 85.98,6.71 85.98,7.52 arc(85.93,7.77) 85.79,7.99 arc(85.65,8.2) 85.6,8.45 C9.1
PCIET5-: length 5.2
  Bottom Layer w0.15: F1.A40 86.65,5.66 arc(86.58,6.03) 86.36,6.35 arc(86.27,6.49) 86.24,6.65 86.24,7.52 arc(86.29,7.77) 86.43,7.99 arc(86.57,8.2) 86.62,8.45 C10.1
